# Altium project UZ_D_Voltage.PrjPCB (part 3 of 3)
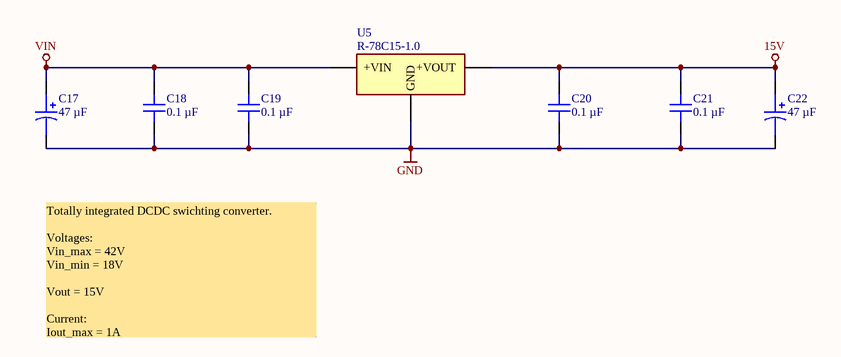
[diagram p17: 15V_PowerSupply.SchDoc]

## Nets that join several sheets
3V3_PER: TopSheet (R1.1), 3V3_to_5V (5 pins), SigCon_top/LS5V_top/LS5V_B (C1A.2 C2A.2 U6A.31 U6A.42), SigCon_top/LS5V_top/LS5V_A (C1B.2 C2B.2 U6B.31 U6B.42), SigCon_top/RS422_rec_top/RS422_rec_H (C6A.2 U4A.12 U4A.16), SigCon_top/RS422_rec_top/RS422_rec1 (C6B.2 U4B.12 U4B.16), SigCon_top/RS422_rec_top/RS422_rec2 (C6C.2 U4C.12 U4C.16), SigCon_top/RS422_rec_top/RS422_rec3 (C6D.2 U4D.12 U4D.16), SigCon_top/RS422_rec_top/RS422_rec4 (C6E.2 U4E.12 U4E.16), SigCon_top/RS422_rec_top/RS422_rec5 (C6F.2 U4F.12 U4F.16), SigCon_top/RS422_rec_top/RS422_rec6 (C6G.2 U4G.12 U4G.16), SigCon_top/RS422_rec_top/RS422_rec7 (C6H.2 U4H.12 U4H.16), SignalBundling (X3.10), DigitalCarrierPlug (X1.13 X1.14)
5V_PER: TopSheet (D1.2 D2.2), SigCon_top/LS5V_top/LS5V_B (C3A.2 C4A.2 U6A.7 U6A.18), SigCon_top/LS5V_top/LS5V_A (C3B.2 C4B.2 U6B.7 U6B.18), 5V_to_15V (R2.1), SigCon_top/LS15V_top/LS15V1 (C23A.2 U2A.1), SigCon_top/LS15V_top/LS15V2 (C23B.2 U2B.1), SigCon_top/LS15V_top/LS15V3 (C23C.2 U2C.1), SigCon_top/LS15V_top/LS15V4 (C23D.2 U2D.1), SigCon_top/LS15V_top/LS15V5 (C23E.2 U2E.1), SigCon_top/RS422_top/RS422A (C5A.2 U3A.12 U3A.16), SigCon_top/RS422_top/RS4221 (C5B.2 U3B.12 U3B.16), SigCon_top/RS422_top/RS4222 (C5C.2 U3C.12 U3C.16), SigCon_top/RS422_top/RS4223 (C5D.2 U3D.12 U3D.16), SigCon_top/RS422_top/RS4224 (C5E.2 U3E.12 U3E.16), SigCon_top/RS422_top/RS4225 (C5F.2 U3F.12 U3F.16), SigCon_top/RS422_top/RS4226 (C5G.2 U3G.12 U3G.16), SigCon_top/RS422_top/RS4227 (C5H.2 U3H.12 U3H.16), SigCon_top/RS422_rec_top/RS422_rec_H (U4A.1 U4A.7), SignalBundling (X3.20), DigitalCarrierPlug (X1.9 X1.10)
15V: SigCon_top/LS15V_top/LS15V1 (C24A.2 U2A.16), SigCon_top/LS15V_top/LS15V2 (C24B.2 U2B.16), SigCon_top/LS15V_top/LS15V3 (C24C.2 U2C.16), SigCon_top/LS15V_top/LS15V4 (C24D.2 U2D.16), SigCon_top/LS15V_top/LS15V5 (C24E.2 U2E.16), SignalBundling (X2.10), 15V_PowerSupply (C20.2 C21.2 C22.1 U5.3)
GND: TopSheet (R9.1 R10.1 R11.1), 3V3_to_5V (6 pins), SigCon_top/LS5V_top/LS5V_B (12 pins), SigCon_top/LS5V_top/LS5V_A (12 pins), 5V_to_15V (R12.1), SigCon_top/LS15V_top/LS15V1 (C23A.1 C24A.1 U2A.8), SigCon_top/LS15V_top/LS15V2 (C23B.1 C24B.1 U2B.8), SigCon_top/LS15V_top/LS15V3 (C23C.1 C24C.1 U2C.8), SigCon_top/LS15V_top/LS15V4 (C23D.1 C24D.1 U2D.8), SigCon_top/LS15V_top/LS15V5 (C23E.1 C24E.1 U2E.8), SigCon_top/RS422_top/RS422A (C5A.1 U3A.1 U3A.7 U3A.8), SigCon_top/RS422_top/RS4221 (C5B.1 U3B.8), SigCon_top/RS422_top/RS4222 (C5C.1 U3C.8), SigCon_top/RS422_top/RS4223 (C5D.1 U3D.8), SigCon_top/RS422_top/RS4224 (C5E.1 U3E.8), SigCon_top/RS422_top/RS4225 (C5F.1 U3F.8), SigCon_top/RS422_top/RS4226 (C5G.1 U3G.8), SigCon_top/RS422_top/RS4227 (C5H.1 U3H.8), SigCon_top/RS422_rec_top/RS422_rec_H (C6A.1 U4A.2 U4A.6 U4A.8), SigCon_top/RS422_rec_top/RS422_rec1 (C6B.1 U4B.8), SigCon_top/RS422_rec_top/RS422_rec2 (C6C.1 U4C.8), SigCon_top/RS422_rec_top/RS422_rec3 (C6D.1 U4D.8), SigCon_top/RS422_rec_top/RS422_rec4 (C6E.1 U4E.8), SigCon_top/RS422_rec_top/RS422_rec5 (C6F.1 U4F.8), SigCon_top/RS422_rec_top/RS422_rec6 (C6G.1 U4G.8), SigCon_top/RS422_rec_top/RS422_rec7 (C6H.1 U4H.8), SignalBundling (35 pins), DigitalCarrierPlug (47 pins), 15V_PowerSupply (7 pins)
VIN: SignalBundling (X2.1 X3.1), DigitalCarrierPlug (X1.5 X1.6), 15V_PowerSupply (C17.1 C18.2 C19.2 U5.1)
1B1: SigCon_top/LS5V_top/LS5V_B (U6A.2), Jumper5VLS (R65.2), Snubber5VLS (R159.1)
1B2: SigCon_top/LS5V_top/LS5V_B (U6A.3), Jumper5VLS (R66.2), Snubber5VLS (R158.1)
1B3: SigCon_top/LS5V_top/LS5V_B (U6A.5), Jumper5VLS (R67.2), Snubber5VLS (R157.1)
1B3: SigCon_top/LS5V_top/LS5V_A (U6B.5), Jumper5VLS (R51.2), Snubber5VLS (R173.1)
1B4: SigCon_top/LS5V_top/LS5V_B (U6A.6), Jumper5VLS (R68.2), Snubber5VLS (R156.1)
1B4: SigCon_top/LS5V_top/LS5V_A (U6B.6), Jumper5VLS (R52.2), Snubber5VLS (R172.1)
1B5: SigCon_top/LS5V_top/LS5V_B (U6A.8), Jumper5VLS (R69.2), Snubber5VLS (R155.1)
1B5: SigCon_top/LS5V_top/LS5V_A (U6B.8), Jumper5VLS (R53.2), Snubber5VLS (R171.1)
1B6: SigCon_top/LS5V_top/LS5V_B (U6A.9), Jumper5VLS (R70.2), Snubber5VLS (R154.1)
1B6: SigCon_top/LS5V_top/LS5V_A (U6B.9), Jumper5VLS (R54.2), Snubber5VLS (R170.1)
1B7: SigCon_top/LS5V_top/LS5V_B (U6A.11), Jumper5VLS (R71.2), Snubber5VLS (R153.1)
1B7: SigCon_top/LS5V_top/LS5V_A (U6B.11), Jumper5VLS (R55.2), Snubber5VLS (R169.1)
1B8: SigCon_top/LS5V_top/LS5V_B (U6A.12), Jumper5VLS (R72.2), Snubber5VLS (R152.1)
1B8: SigCon_top/LS5V_top/LS5V_A (U6B.12), Jumper5VLS (R56.2), Snubber5VLS (R168.1)
2B1: SigCon_top/LS5V_top/LS5V_B (U6A.13), Jumper5VLS (R73.2), Snubber5VLS (R151.1)
2B1: SigCon_top/LS5V_top/LS5V_A (U6B.13), Jumper5VLS (R57.2), Snubber5VLS (R167.1)
2B2: SigCon_top/LS5V_top/LS5V_B (U6A.14), Jumper5VLS (R74.2), Snubber5VLS (R150.1)
2B2: SigCon_top/LS5V_top/LS5V_A (U6B.14), Jumper5VLS (R58.2), Snubber5VLS (R166.1)
2B3: SigCon_top/LS5V_top/LS5V_B (U6A.16), Jumper5VLS (R75.2), Snubber5VLS (R149.1)
2B3: SigCon_top/LS5V_top/LS5V_A (U6B.16), Jumper5VLS (R59.2), Snubber5VLS (R165.1)
2B4: SigCon_top/LS5V_top/LS5V_B (U6A.17), Jumper5VLS (R76.2), Snubber5VLS (R148.1)
2B4: SigCon_top/LS5V_top/LS5V_A (U6B.17), Jumper5VLS (R60.2), Snubber5VLS (R164.1)
2B5: SigCon_top/LS5V_top/LS5V_B (U6A.19), Jumper5VLS (R77.2), Snubber5VLS (R147.1)
2B5: SigCon_top/LS5V_top/LS5V_A (U6B.19), Jumper5VLS (R61.2), Snubber5VLS (R163.1)
2B6: SigCon_top/LS5V_top/LS5V_B (U6A.20), Jumper5VLS (R78.2), Snubber5VLS (R146.1)
2B6: SigCon_top/LS5V_top/LS5V_A (U6B.20), Jumper5VLS (R62.2), Snubber5VLS (R162.1)
2B7: SigCon_top/LS5V_top/LS5V_B (U6A.22), Jumper5VLS (R79.2), Snubber5VLS (R145.1)
2B7: SigCon_top/LS5V_top/LS5V_A (U6B.22), Jumper5VLS (R63.2), Snubber5VLS (R161.1)
2B8: SigCon_top/LS5V_top/LS5V_B (U6A.23), Jumper5VLS (R80.2), Snubber5VLS (R144.1)
2B8: SigCon_top/LS5V_top/LS5V_A (U6B.23), Jumper5VLS (R64.2), Snubber5VLS (R160.1)
DIG_I_DIFF_A_N1: SigCon_top/RS422_top/RS4221 (U3B.11), SigCon_top/RS422_rec_top/RS422_rec1 (U4B.15), TermSingleAndDiff (R81.1)
DIG_I_DIFF_A_N2: SigCon_top/RS422_top/RS4222 (U3C.11), SigCon_top/RS422_rec_top/RS422_rec2 (U4C.15), TermSingleAndDiff (R89.1)
DIG_I_DIFF_A_N3: SigCon_top/RS422_top/RS4223 (U3D.11), SigCon_top/RS422_rec_top/RS422_rec3 (U4D.15), TermSingleAndDiff (R113.1)
DIG_I_DIFF_A_N4: SigCon_top/RS422_top/RS4224 (U3E.11), SigCon_top/RS422_rec_top/RS422_rec4 (U4E.15), TermSingleAndDiff (R121.1)
DIG_I_DIFF_A_N5: SigCon_top/RS422_top/RS4225 (U3F.11), SigCon_top/RS422_rec_top/RS422_rec5 (U4F.9), TermSingleAndDiff (R97.1)
DIG_I_DIFF_A_N6: SigCon_top/RS422_top/RS4226 (U3G.11), SigCon_top/RS422_rec_top/RS422_rec6 (U4G.9), TermSingleAndDiff (R105.1)
DIG_I_DIFF_A_N7: SigCon_top/RS422_top/RS4227 (U3H.11), SigCon_top/RS422_rec_top/RS422_rec7 (U4H.9), TermSingleAndDiff (R129.1)
DIG_I_DIFF_A_N8: SigCon_top/RS422_top/RS422A (U3A.13), SigCon_top/RS422_rec_top/RS422_rec_H (U4A.9), TermSingleAndDiff (R137.1)
DIG_I_DIFF_A_P1: SigCon_top/RS422_top/RS4221 (U3B.10), SigCon_top/RS422_rec_top/RS422_rec1 (U4B.14), NetTieSingleAndDiff (NT1.2)
DIG_I_DIFF_A_P2: SigCon_top/RS422_top/RS4222 (U3C.10), SigCon_top/RS422_rec_top/RS422_rec2 (U4C.14), NetTieSingleAndDiff (NT5.1)
DIG_I_DIFF_A_P3: SigCon_top/RS422_top/RS4223 (U3D.10), SigCon_top/RS422_rec_top/RS422_rec3 (U4D.14), NetTieSingleAndDiff (NT9.2)
DIG_I_DIFF_A_P4: SigCon_top/RS422_top/RS4224 (U3E.10), SigCon_top/RS422_rec_top/RS422_rec4 (U4E.14), NetTieSingleAndDiff (NT13.2)
DIG_I_DIFF_A_P5: SigCon_top/RS422_top/RS4225 (U3F.10), SigCon_top/RS422_rec_top/RS422_rec5 (U4F.10), NetTieSingleAndDiff (NT17.1)
DIG_I_DIFF_A_P6: SigCon_top/RS422_top/RS4226 (U3G.10), SigCon_top/RS422_rec_top/RS422_rec6 (U4G.10), NetTieSingleAndDiff (NT21.2)
DIG_I_DIFF_A_P7: SigCon_top/RS422_top/RS4227 (U3H.10), SigCon_top/RS422_rec_top/RS422_rec7 (U4H.10), NetTieSingleAndDiff (NT25.1)
DIG_I_DIFF_A_P8: SigCon_top/RS422_top/RS422A (U3A.14), SigCon_top/RS422_rec_top/RS422_rec_H (U4A.10), NetTieSingleAndDiff (NT29.2)
DIG_I_DIFF_B_N1: SigCon_top/RS422_top/RS4221 (U3B.13), SigCon_top/RS422_rec_top/RS422_rec1 (U4B.9), TermSingleAndDiff (R83.1)
DIG_I_DIFF_B_N2: SigCon_top/RS422_top/RS4222 (U3C.13), SigCon_top/RS422_rec_top/RS422_rec2 (U4C.9), TermSingleAndDiff (R91.1)
DIG_I_DIFF_B_N3: SigCon_top/RS422_top/RS4223 (U3D.13), SigCon_top/RS422_rec_top/RS422_rec3 (U4D.9), TermSingleAndDiff (R115.1)
DIG_I_DIFF_B_N4: SigCon_top/RS422_top/RS4224 (U3E.13), SigCon_top/RS422_rec_top/RS422_rec4 (U4E.9), TermSingleAndDiff (R123.1)
DIG_I_DIFF_B_N5: SigCon_top/RS422_top/RS4225 (U3F.13), SigCon_top/RS422_rec_top/RS422_rec5 (U4F.15), TermSingleAndDiff (R99.1)
DIG_I_DIFF_B_N6: SigCon_top/RS422_top/RS4226 (U3G.13), SigCon_top/RS422_rec_top/RS422_rec6 (U4G.15), TermSingleAndDiff (R107.1)
DIG_I_DIFF_B_N7: SigCon_top/RS422_top/RS4227 (U3H.13), SigCon_top/RS422_rec_top/RS422_rec7 (U4H.15), TermSingleAndDiff (R131.1)
DIG_I_DIFF_B_P1: SigCon_top/RS422_top/RS4221 (U3B.14), SigCon_top/RS422_rec_top/RS422_rec1 (U4B.10), NetTieSingleAndDiff (NT2.2)
DIG_I_DIFF_B_P2: SigCon_top/RS422_top/RS4222 (U3C.14), SigCon_top/RS422_rec_top/RS422_rec2 (U4C.10), NetTieSingleAndDiff (NT6.2)
DIG_I_DIFF_B_P3: SigCon_top/RS422_top/RS4223 (U3D.14), SigCon_top/RS422_rec_top/RS422_rec3 (U4D.10), NetTieSingleAndDiff (NT10.1)
DIG_I_DIFF_B_P4: SigCon_top/RS422_top/RS4224 (U3E.14), SigCon_top/RS422_rec_top/RS422_rec4 (U4E.10), NetTieSingleAndDiff (NT14.1)
DIG_I_DIFF_B_P5: SigCon_top/RS422_top/RS4225 (U3F.14), SigCon_top/RS422_rec_top/RS422_rec5 (U4F.14), NetTieSingleAndDiff (NT18.2)
DIG_I_DIFF_B_P6: SigCon_top/RS422_top/RS4226 (U3G.14), SigCon_top/RS422_rec_top/RS422_rec6 (U4G.14), NetTieSingleAndDiff (NT22.1)
DIG_I_DIFF_B_P7: SigCon_top/RS422_top/RS4227 (U3H.14), SigCon_top/RS422_rec_top/RS422_rec7 (U4H.14), NetTieSingleAndDiff (NT26.1)
DIG_I_DIFF_C_N1: SigCon_top/RS422_top/RS4221 (U3B.5), SigCon_top/RS422_rec_top/RS422_rec1 (U4B.1), TermSingleAndDiff (R86.1)
DIG_I_DIFF_C_N2: SigCon_top/RS422_top/RS4222 (U3C.5), SigCon_top/RS422_rec_top/RS422_rec2 (U4C.1), TermSingleAndDiff (R94.1)
DIG_I_DIFF_C_N3: SigCon_top/RS422_top/RS4223 (U3D.5), SigCon_top/RS422_rec_top/RS422_rec3 (U4D.1), TermSingleAndDiff (R118.1)
DIG_I_DIFF_C_N4: SigCon_top/RS422_top/RS4224 (U3E.5), SigCon_top/RS422_rec_top/RS422_rec4 (U4E.1), TermSingleAndDiff (R126.1)
DIG_I_DIFF_C_N5: SigCon_top/RS422_top/RS4225 (U3F.5), SigCon_top/RS422_rec_top/RS422_rec5 (U4F.7), TermSingleAndDiff (R102.1)
DIG_I_DIFF_C_N6: SigCon_top/RS422_top/RS4226 (U3G.5), SigCon_top/RS422_rec_top/RS422_rec6 (U4G.7), TermSingleAndDiff (R110.1)
DIG_I_DIFF_C_N7: SigCon_top/RS422_top/RS4227 (U3H.5), SigCon_top/RS422_rec_top/RS422_rec7 (U4H.7), TermSingleAndDiff (R134.1)
DIG_I_DIFF_C_N8: SigCon_top/RS422_top/RS422A (U3A.11), SigCon_top/RS422_rec_top/RS422_rec_H (U4A.15), TermSingleAndDiff (R140.1)
DIG_I_DIFF_C_P1: SigCon_top/RS422_top/RS4221 (U3B.6), SigCon_top/RS422_rec_top/RS422_rec1 (U4B.2), NetTieSingleAndDiff (NT3.2)
DIG_I_DIFF_C_P2: SigCon_top/RS422_top/RS4222 (U3C.6), SigCon_top/RS422_rec_top/RS422_rec2 (U4C.2), NetTieSingleAndDiff (NT7.1)
DIG_I_DIFF_C_P3: SigCon_top/RS422_top/RS4223 (U3D.6), SigCon_top/RS422_rec_top/RS422_rec3 (U4D.2), NetTieSingleAndDiff (NT11.2)
DIG_I_DIFF_C_P4: SigCon_top/RS422_top/RS4224 (U3E.6), SigCon_top/RS422_rec_top/RS422_rec4 (U4E.2), NetTieSingleAndDiff (NT15.1)
DIG_I_DIFF_C_P5: SigCon_top/RS422_top/RS4225 (U3F.6), SigCon_top/RS422_rec_top/RS422_rec5 (U4F.6), NetTieSingleAndDiff (NT19.1)
DIG_I_DIFF_C_P6: SigCon_top/RS422_top/RS4226 (U3G.6), SigCon_top/RS422_rec_top/RS422_rec6 (U4G.6), NetTieSingleAndDiff (NT23.2)
DIG_I_DIFF_C_P7: SigCon_top/RS422_top/RS4227 (U3H.6), SigCon_top/RS422_rec_top/RS422_rec7 (U4H.6), NetTieSingleAndDiff (NT27.2)
DIG_I_DIFF_C_P8: SigCon_top/RS422_top/RS422A (U3A.10), SigCon_top/RS422_rec_top/RS422_rec_H (U4A.14), NetTieSingleAndDiff (NT30.2)
DIG_I_DIFF_D_N1: SigCon_top/RS422_top/RS4221 (U3B.3), SigCon_top/RS422_rec_top/RS422_rec1 (U4B.7), TermSingleAndDiff (R88.1)
DIG_I_DIFF_D_N2: SigCon_top/RS422_top/RS4222 (U3C.3), SigCon_top/RS422_rec_top/RS422_rec2 (U4C.7), TermSingleAndDiff (R96.1)
DIG_I_DIFF_D_N3: SigCon_top/RS422_top/RS4223 (U3D.3), SigCon_top/RS422_rec_top/RS422_rec3 (U4D.7), TermSingleAndDiff (R120.1)
DIG_I_DIFF_D_N4: SigCon_top/RS422_top/RS4224 (U3E.3), SigCon_top/RS422_rec_top/RS422_rec4 (U4E.7), TermSingleAndDiff (R128.1)
DIG_I_DIFF_D_N5: SigCon_top/RS422_top/RS4225 (U3F.3), SigCon_top/RS422_rec_top/RS422_rec5 (U4F.1), TermSingleAndDiff (R104.1)
DIG_I_DIFF_D_N6: SigCon_top/RS422_top/RS4226 (U3G.3), SigCon_top/RS422_rec_top/RS422_rec6 (U4G.1), TermSingleAndDiff (R112.1)
DIG_I_DIFF_D_N7: SigCon_top/RS422_top/RS4227 (U3H.3), SigCon_top/RS422_rec_top/RS422_rec7 (U4H.1), TermSingleAndDiff (R136.1)
DIG_I_DIFF_D_P1: SigCon_top/RS422_top/RS4221 (U3B.2), SigCon_top/RS422_rec_top/RS422_rec1 (U4B.6), NetTieSingleAndDiff (NT4.1)
DIG_I_DIFF_D_P2: SigCon_top/RS422_top/RS4222 (U3C.2), SigCon_top/RS422_rec_top/RS422_rec2 (U4C.6), NetTieSingleAndDiff (NT8.1)
DIG_I_DIFF_D_P3: SigCon_top/RS422_top/RS4223 (U3D.2), SigCon_top/RS422_rec_top/RS422_rec3 (U4D.6), NetTieSingleAndDiff (NT12.2)
DIG_I_DIFF_D_P4: SigCon_top/RS422_top/RS4224 (U3E.2), SigCon_top/RS422_rec_top/RS422_rec4 (U4E.6), NetTieSingleAndDiff (NT16.1)
DIG_I_DIFF_D_P5: SigCon_top/RS422_top/RS4225 (U3F.2), SigCon_top/RS422_rec_top/RS422_rec5 (U4F.2), NetTieSingleAndDiff (NT20.1)
DIG_I_DIFF_D_P6: SigCon_top/RS422_top/RS4226 (U3G.2), SigCon_top/RS422_rec_top/RS422_rec6 (U4G.2), NetTieSingleAndDiff (NT24.1)
DIG_I_DIFF_D_P7: SigCon_top/RS422_top/RS4227 (U3H.2), SigCon_top/RS422_rec_top/RS422_rec7 (U4H.2), NetTieSingleAndDiff (NT28.1)
DIG_IO_00: SigCon_top/LS5V_top/LS5V_B (U6A.26), Jumper5VLS (R80.1), DigitalCarrierPlug (X1.17)
DIG_IO_01: SigCon_top/LS5V_top/LS5V_B (U6A.27), Jumper5VLS (R79.1), DigitalCarrierPlug (X1.18)
DIG_IO_02: SigCon_top/LS5V_top/LS5V_B (U6A.29), Jumper5VLS (R78.1), DigitalCarrierPlug (X1.21)
DIG_IO_03: SigCon_top/LS5V_top/LS5V_B (U6A.30), Jumper5VLS (R77.1), DigitalCarrierPlug (X1.22)
DIG_IO_04: SigCon_top/LS5V_top/LS5V_B (U6A.32), Jumper5VLS (R76.1), DigitalCarrierPlug (X1.25)
DIG_IO_05: SigCon_top/LS5V_top/LS5V_B (U6A.33), Jumper5VLS (R75.1), DigitalCarrierPlug (X1.26)
DIG_IO_5V_A1: Snubber5VLS (R144.2), SigCon_top/LS15V_top/LS15V1 (R3A.1 U2A.3), SigCon_top/RS422_top/RS4221 (U3B.9), SigCon_top/RS422_rec_top/RS422_rec1 (U4B.13)
DIG_IO_5V_A2: Snubber5VLS (R150.2), SigCon_top/LS15V_top/LS15V2 (R3B.1 U2B.3), SigCon_top/RS422_top/RS4222 (U3C.7), SigCon_top/RS422_rec_top/RS422_rec2 (U4C.3)
DIG_IO_5V_A3: Snubber5VLS (R156.2), SigCon_top/LS15V_top/LS15V3 (R3C.1 U2C.3), SigCon_top/RS422_top/RS4224 (U3E.9), SigCon_top/RS422_rec_top/RS422_rec4 (U4E.13)
DIG_IO_5V_A4: Snubber5VLS (R162.2), SigCon_top/LS15V_top/LS15V4 (R3D.1 U2D.3), SigCon_top/RS422_top/RS4225 (U3F.7), SigCon_top/RS422_rec_top/RS422_rec5 (U4F.5)
DIG_IO_5V_A5: Snubber5VLS (R168.2), SigCon_top/LS15V_top/LS15V5 (R3E.1 U2E.3), SigCon_top/RS422_top/RS4227 (U3H.9), SigCon_top/RS422_rec_top/RS422_rec7 (U4H.11)
DIG_IO_5V_B1: Snubber5VLS (R145.2), SigCon_top/LS15V_top/LS15V1 (R4A.1 U2A.5), SigCon_top/RS422_top/RS4221 (U3B.15), SigCon_top/RS422_rec_top/RS422_rec1 (U4B.11)
DIG_IO_5V_B2: Snubber5VLS (R151.2), SigCon_top/LS15V_top/LS15V2 (R4B.1 U2B.5), SigCon_top/RS422_top/RS4222 (U3C.1), SigCon_top/RS422_rec_top/RS422_rec2 (U4C.5)
DIG_IO_5V_B3: Snubber5VLS (R157.2), SigCon_top/LS15V_top/LS15V3 (R4C.1 U2C.5), SigCon_top/RS422_top/RS4224 (U3E.15), SigCon_top/RS422_rec_top/RS422_rec4 (U4E.11)
DIG_IO_5V_B4: Snubber5VLS (R163.2), SigCon_top/LS15V_top/LS15V4 (R4D.1 U2D.5), SigCon_top/RS422_top/RS4225 (U3F.1), SigCon_top/RS422_rec_top/RS422_rec5 (U4F.3)
DIG_IO_5V_B5: Snubber5VLS (R169.2), SigCon_top/LS15V_top/LS15V5 (R4E.1 U2E.5), SigCon_top/RS422_top/RS4227 (U3H.15), SigCon_top/RS422_rec_top/RS422_rec7 (U4H.13)
DIG_IO_5V_C1: Snubber5VLS (R146.2), SigCon_top/LS15V_top/LS15V1 (R5A.1 U2A.7), SigCon_top/RS422_top/RS4221 (U3B.7), SigCon_top/RS422_rec_top/RS422_rec1 (U4B.3)
DIG_IO_5V_C2: Snubber5VLS (R152.2), SigCon_top/LS15V_top/LS15V2 (R5B.1 U2B.7), SigCon_top/RS422_top/RS4223 (U3D.9), SigCon_top/RS422_rec_top/RS422_rec3 (U4D.13)
DIG_IO_5V_C3: Snubber5VLS (R158.2), SigCon_top/LS15V_top/LS15V3 (R5C.1 U2C.7), SigCon_top/RS422_top/RS4224 (U3E.7), SigCon_top/RS422_rec_top/RS422_rec4 (U4E.3)
DIG_IO_5V_C4: Snubber5VLS (R164.2), SigCon_top/LS15V_top/LS15V4 (R5D.1 U2D.7), SigCon_top/RS422_top/RS4226 (U3G.9), SigCon_top/RS422_rec_top/RS422_rec6 (U4G.11)
DIG_IO_5V_C5: Snubber5VLS (R170.2), SigCon_top/LS15V_top/LS15V5 (R5E.1 U2E.7), SigCon_top/RS422_top/RS4227 (U3H.7), SigCon_top/RS422_rec_top/RS422_rec7 (U4H.5)
DIG_IO_5V_D1: Snubber5VLS (R147.2), SigCon_top/LS15V_top/LS15V1 (R8A.1 U2A.14), SigCon_top/RS422_top/RS4221 (U3B.1), SigCon_top/RS422_rec_top/RS422_rec1 (U4B.5)
DIG_IO_5V_D2: Snubber5VLS (R153.2), SigCon_top/LS15V_top/LS15V2 (R8B.1 U2B.14), SigCon_top/RS422_top/RS4223 (U3D.15), SigCon_top/RS422_rec_top/RS422_rec3 (U4D.11)
DIG_IO_5V_D3: Snubber5VLS (R159.2), SigCon_top/LS15V_top/LS15V3 (R8C.1 U2C.14), SigCon_top/RS422_top/RS4224 (U3E.1), SigCon_top/RS422_rec_top/RS422_rec4 (U4E.5)
DIG_IO_5V_D4: Snubber5VLS (R165.2), SigCon_top/LS15V_top/LS15V4 (R8D.1 U2D.14), SigCon_top/RS422_top/RS4226 (U3G.15), SigCon_top/RS422_rec_top/RS422_rec6 (U4G.13)
DIG_IO_5V_D5: Snubber5VLS (R171.2), SigCon_top/LS15V_top/LS15V5 (R8E.1 U2E.14), SigCon_top/RS422_top/RS4227 (U3H.1), SigCon_top/RS422_rec_top/RS422_rec7 (U4H.3)
DIG_IO_5V_E1: Snubber5VLS (R148.2), SigCon_top/LS15V_top/LS15V1 (R6A.1 U2A.9), SigCon_top/RS422_top/RS4222 (U3C.9), SigCon_top/RS422_rec_top/RS422_rec2 (U4C.13)
DIG_IO_5V_E2: Snubber5VLS (R154.2), SigCon_top/LS15V_top/LS15V2 (R6B.1 U2B.9), SigCon_top/RS422_top/RS4223 (U3D.7), SigCon_top/RS422_rec_top/RS422_rec3 (U4D.3)
DIG_IO_5V_E3: Snubber5VLS (R160.2), SigCon_top/LS15V_top/LS15V3 (R6C.1 U2C.9), SigCon_top/RS422_top/RS4225 (U3F.9), SigCon_top/RS422_rec_top/RS422_rec5 (U4F.11)
DIG_IO_5V_E4: Snubber5VLS (R166.2), SigCon_top/LS15V_top/LS15V4 (R6D.1 U2D.9), SigCon_top/RS422_top/RS4226 (U3G.7), SigCon_top/RS422_rec_top/RS422_rec6 (U4G.5)
DIG_IO_5V_E5: Snubber5VLS (R172.2), SigCon_top/LS15V_top/LS15V5 (R6E.1 U2E.9), SigCon_top/RS422_top/RS422A (U3A.15), SigCon_top/RS422_rec_top/RS422_rec_H (U4A.11)
DIG_IO_5V_F1: Snubber5VLS (R149.2), SigCon_top/LS15V_top/LS15V1 (R7A.1 U2A.11), SigCon_top/RS422_top/RS4222 (U3C.15), SigCon_top/RS422_rec_top/RS422_rec2 (U4C.11)
DIG_IO_5V_F2: Snubber5VLS (R155.2), SigCon_top/LS15V_top/LS15V2 (R7B.1 U2B.11), SigCon_top/RS422_top/RS4223 (U3D.1), SigCon_top/RS422_rec_top/RS422_rec3 (U4D.5)
DIG_IO_5V_F3: Snubber5VLS (R161.2), SigCon_top/LS15V_top/LS15V3 (R7C.1 U2C.11), SigCon_top/RS422_top/RS4225 (U3F.15), SigCon_top/RS422_rec_top/RS422_rec5 (U4F.13)
DIG_IO_5V_F4: Snubber5VLS (R167.2), SigCon_top/LS15V_top/LS15V4 (R7D.1 U2D.11), SigCon_top/RS422_top/RS4226 (U3G.1), SigCon_top/RS422_rec_top/RS422_rec6 (U4G.3)
DIG_IO_5V_F5: Snubber5VLS (R173.2), SigCon_top/LS15V_top/LS15V5 (R7E.1 U2E.11), SigCon_top/RS422_top/RS422A (U3A.9), SigCon_top/RS422_rec_top/RS422_rec_H (U4A.13)
DIG_IO_06: SigCon_top/LS5V_top/LS5V_B (U6A.35), Jumper5VLS (R74.1), DigitalCarrierPlug (X1.29)
DIG_IO_07: SigCon_top/LS5V_top/LS5V_B (U6A.36), Jumper5VLS (R73.1), DigitalCarrierPlug (X1.30)
DIG_IO_08: SigCon_top/LS5V_top/LS5V_B (U6A.37), Jumper5VLS (R72.1), DigitalCarrierPlug (X1.33)
DIG_IO_09: SigCon_top/LS5V_top/LS5V_B (U6A.38), Jumper5VLS (R71.1), DigitalCarrierPlug (X1.34)
DIG_IO_10: SigCon_top/LS5V_top/LS5V_B (U6A.40), Jumper5VLS (R70.1), DigitalCarrierPlug (X1.37)
DIG_IO_11: SigCon_top/LS5V_top/LS5V_B (U6A.41), Jumper5VLS (R69.1), DigitalCarrierPlug (X1.38)
DIG_IO_12: SigCon_top/LS5V_top/LS5V_B (U6A.43), Jumper5VLS (R68.1), DigitalCarrierPlug (X1.41)
DIG_IO_13: SigCon_top/LS5V_top/LS5V_B (U6A.44), Jumper5VLS (R67.1), DigitalCarrierPlug (X1.42)
DIG_IO_14: SigCon_top/LS5V_top/LS5V_B (U6A.46), Jumper5VLS (R66.1), DigitalCarrierPlug (X1.45)
DIG_IO_15: SigCon_top/LS5V_top/LS5V_B (U6A.47), Jumper5VLS (R65.1), DigitalCarrierPlug (X1.46)
DIG_IO_16: SigCon_top/LS5V_top/LS5V_A (U6B.26), Jumper5VLS (R64.1), DigitalCarrierPlug (X1.49)
DIG_IO_17: SigCon_top/LS5V_top/LS5V_A (U6B.27), Jumper5VLS (R63.1), DigitalCarrierPlug (X1.50)
DIG_IO_18: SigCon_top/LS5V_top/LS5V_A (U6B.29), Jumper5VLS (R62.1), DigitalCarrierPlug (X1.53)
DIG_IO_19: SigCon_top/LS5V_top/LS5V_A (U6B.30), Jumper5VLS (R61.1), DigitalCarrierPlug (X1.54)
DIG_IO_20: SigCon_top/LS5V_top/LS5V_A (U6B.32), Jumper5VLS (R60.1), DigitalCarrierPlug (X1.57)
DIG_IO_21: SigCon_top/LS5V_top/LS5V_A (U6B.33), Jumper5VLS (R59.1), DigitalCarrierPlug (X1.58)
DIG_IO_22: SigCon_top/LS5V_top/LS5V_A (U6B.35), Jumper5VLS (R58.1), DigitalCarrierPlug (X1.61)
DIG_IO_23: SigCon_top/LS5V_top/LS5V_A (U6B.36), Jumper5VLS (R57.1), DigitalCarrierPlug (X1.62)
DIG_IO_24: SigCon_top/LS5V_top/LS5V_A (U6B.37), Jumper5VLS (R56.1), DigitalCarrierPlug (X1.65)
DIG_IO_25: SigCon_top/LS5V_top/LS5V_A (U6B.38), Jumper5VLS (R55.1), DigitalCarrierPlug (X1.66)
DIG_IO_26: SigCon_top/LS5V_top/LS5V_A (U6B.40), Jumper5VLS (R54.1), DigitalCarrierPlug (X1.69)
DIG_IO_27: SigCon_top/LS5V_top/LS5V_A (U6B.41), Jumper5VLS (R53.1), DigitalCarrierPlug (X1.70)
DIG_IO_28: SigCon_top/LS5V_top/LS5V_A (U6B.43), Jumper5VLS (R52.1), DigitalCarrierPlug (X1.73)
DIG_IO_29: SigCon_top/LS5V_top/LS5V_A (U6B.44), Jumper5VLS (R51.1), DigitalCarrierPlug (X1.74)
DIG_IO_N0: SignalBundling (R21.1 X2.17), TermSingleAndDiff (R81.2)
DIG_IO_N1: SignalBundling (R22.1 X2.18), TermSingleAndDiff (R83.2)
DIG_IO_N2: SignalBundling (R23.1 X2.19), TermSingleAndDiff (R86.2)
DIG_IO_N3: SignalBundling (R24.1 X2.20), TermSingleAndDiff (R88.2)
DIG_IO_N4: SignalBundling (R25.1 X2.21), TermSingleAndDiff (R89.2)
DIG_IO_N5: SignalBundling (R26.1 X2.22), TermSingleAndDiff (R91.2)
DIG_IO_N6: SignalBundling (R27.1 X2.23), TermSingleAndDiff (R94.2)
DIG_IO_N7: SignalBundling (R28.1 X2.24), TermSingleAndDiff (R96.2)
DIG_IO_N8: SignalBundling (R29.1 X2.26), TermSingleAndDiff (R113.2)
DIG_IO_N9: SignalBundling (R30.1 X2.27), TermSingleAndDiff (R115.2)
DIG_IO_N10: SignalBundling (R31.1 X2.28), TermSingleAndDiff (R118.2)
DIG_IO_N11: SignalBundling (R32.1 X2.29), TermSingleAndDiff (R120.2)
DIG_IO_N12: SignalBundling (R33.1 X2.30), TermSingleAndDiff (R121.2)
DIG_IO_N13: SignalBundling (R34.1 X3.22), TermSingleAndDiff (R123.2)
DIG_IO_N14: SignalBundling (R35.1 X3.23), TermSingleAndDiff (R126.2)
DIG_IO_N15: SignalBundling (R36.1 X3.24), TermSingleAndDiff (R128.2)
DIG_IO_N16: SignalBundling (R37.1 X3.25), TermSingleAndDiff (R97.2)
DIG_IO_N17: SignalBundling (R38.1 X3.26), TermSingleAndDiff (R99.2)
DIG_IO_N18: SignalBundling (R39.1 X3.27), TermSingleAndDiff (R102.2)
DIG_IO_N19: SignalBundling (R40.1 X3.28), TermSingleAndDiff (R104.2)
DIG_IO_N20: SignalBundling (R41.1 X3.29), TermSingleAndDiff (R105.2)
DIG_IO_N21: SignalBundling (R42.1 X3.31), TermSingleAndDiff (R107.2)
DIG_IO_N22: SignalBundling (R43.1 X3.32), TermSingleAndDiff (R110.2)
DIG_IO_N23: SignalBundling (R44.1 X3.33), TermSingleAndDiff (R112.2)
DIG_IO_N24: SignalBundling (R45.1 X3.34), TermSingleAndDiff (R129.2)
DIG_IO_N25: SignalBundling (R46.1 X3.35), TermSingleAndDiff (R131.2)
DIG_IO_N26: SignalBundling (R47.1 X3.36), TermSingleAndDiff (R134.2)
DIG_IO_N27: SignalBundling (R48.1 X3.37), TermSingleAndDiff (R136.2)
DIG_IO_N28: SignalBundling (R49.1 X3.38), TermSingleAndDiff (R137.2)
DIG_IO_N29: SignalBundling (R50.1 X3.39), TermSingleAndDiff (R140.2)
DIG_IO_P0: SignalBundling (X2.2), TermSingleAndDiff (R82.2)
DIG_IO_P1: SignalBundling (X2.3), TermSingleAndDiff (R84.2)
DIG_IO_P2: SignalBundling (X2.4), TermSingleAndDiff (R85.2)
DIG_IO_P3: SignalBundling (X2.5), TermSingleAndDiff (R87.2)
DIG_IO_P4: SignalBundling (X2.6), TermSingleAndDiff (R90.2)
DIG_IO_P5: SignalBundling (X2.7), TermSingleAndDiff (R92.2)
DIG_IO_P6: SignalBundling (X2.8), TermSingleAndDiff (R93.2)
DIG_IO_P7: SignalBundling (X2.9), TermSingleAndDiff (R95.2)
DIG_IO_P8: SignalBundling (X2.11), TermSingleAndDiff (R114.2)
DIG_IO_P9: SignalBundling (X2.12), TermSingleAndDiff (R116.2)
DIG_IO_P10: SignalBundling (X2.13), TermSingleAndDiff (R117.2)
DIG_IO_P11: SignalBundling (X2.14), TermSingleAndDiff (R119.2)
DIG_IO_P12: SignalBundling (X2.15), TermSingleAndDiff (R122.2)
DIG_IO_P13: SignalBundling (X3.2), TermSingleAndDiff (R124.2)
DIG_IO_P14: SignalBundling (X3.3), TermSingleAndDiff (R125.2)
DIG_IO_P15: SignalBundling (X3.4), TermSingleAndDiff (R127.2)
DIG_IO_P16: SignalBundling (X3.5), TermSingleAndDiff (R98.2)
DIG_IO_P17: SignalBundling (X3.6), TermSingleAndDiff (R100.2)
DIG_IO_P18: SignalBundling (X3.7), TermSingleAndDiff (R101.2)
DIG_IO_P19: SignalBundling (X3.8), TermSingleAndDiff (R103.2)
DIG_IO_P20: SignalBundling (X3.9), TermSingleAndDiff (R106.2)
DIG_IO_P21: SignalBundling (X3.11), TermSingleAndDiff (R108.2)
DIG_IO_P22: SignalBundling (X3.12), TermSingleAndDiff (R109.2)
DIG_IO_P23: SignalBundling (X3.13), TermSingleAndDiff (R111.2)
DIG_IO_P24: SignalBundling (X3.14), TermSingleAndDiff (R130.2)
DIG_IO_P25: SignalBundling (X3.15), TermSingleAndDiff (R132.2)
DIG_IO_P26: SignalBundling (X3.16), TermSingleAndDiff (R133.2)
DIG_IO_P27: SignalBundling (X3.17), TermSingleAndDiff (R135.2)
DIG_IO_P28: SignalBundling (X3.18), TermSingleAndDiff (R138.2)
DIG_IO_P29: SignalBundling (X3.19), TermSingleAndDiff (R139.2)
DIG_IO_SINGLE_A1: SigCon_top/LS15V_top/LS15V1 (R3A.2 U2A.2), NetTieSingleAndDiff (NT1.1)
DIG_IO_SINGLE_A2: SigCon_top/LS15V_top/LS15V2 (R3B.2 U2B.2), NetTieSingleAndDiff (NT7.2)
DIG_IO_SINGLE_A3: SigCon_top/LS15V_top/LS15V3 (R3C.2 U2C.2), NetTieSingleAndDiff (NT13.1)
DIG_IO_SINGLE_A4: SigCon_top/LS15V_top/LS15V4 (R3D.2 U2D.2), NetTieSingleAndDiff (NT19.2)
DIG_IO_SINGLE_A5: SigCon_top/LS15V_top/LS15V5 (R3E.2 U2E.2), NetTieSingleAndDiff (NT25.2)
DIG_IO_SINGLE_B1: SigCon_top/LS15V_top/LS15V1 (R4A.2 U2A.4), NetTieSingleAndDiff (NT2.1)
DIG_IO_SINGLE_B2: SigCon_top/LS15V_top/LS15V2 (R4B.2 U2B.4), NetTieSingleAndDiff (NT8.2)
DIG_IO_SINGLE_B3: SigCon_top/LS15V_top/LS15V3 (R4C.2 U2C.4), NetTieSingleAndDiff (NT14.2)
DIG_IO_SINGLE_B4: SigCon_top/LS15V_top/LS15V4 (R4D.2 U2D.4), NetTieSingleAndDiff (NT20.2)
DIG_IO_SINGLE_B5: SigCon_top/LS15V_top/LS15V5 (R4E.2 U2E.4), NetTieSingleAndDiff (NT26.2)
DIG_IO_SINGLE_C1: SigCon_top/LS15V_top/LS15V1 (R5A.2 U2A.6), NetTieSingleAndDiff (NT3.1)
DIG_IO_SINGLE_C2: SigCon_top/LS15V_top/LS15V2 (R5B.2 U2B.6), NetTieSingleAndDiff (NT9.1)
DIG_IO_SINGLE_C3: SigCon_top/LS15V_top/LS15V3 (R5C.2 U2C.6), NetTieSingleAndDiff (NT15.2)
DIG_IO_SINGLE_C4: SigCon_top/LS15V_top/LS15V4 (R5D.2 U2D.6), NetTieSingleAndDiff (NT21.1)
DIG_IO_SINGLE_C5: SigCon_top/LS15V_top/LS15V5 (R5E.2 U2E.6), NetTieSingleAndDiff (NT27.1)
DIG_IO_SINGLE_D1: SigCon_top/LS15V_top/LS15V1 (R8A.2 U2A.15), NetTieSingleAndDiff (NT4.2)
DIG_IO_SINGLE_D2: SigCon_top/LS15V_top/LS15V2 (R8B.2 U2B.15), NetTieSingleAndDiff (NT10.2)
DIG_IO_SINGLE_D3: SigCon_top/LS15V_top/LS15V3 (R8C.2 U2C.15), NetTieSingleAndDiff (NT16.2)
DIG_IO_SINGLE_D4: SigCon_top/LS15V_top/LS15V4 (R8D.2 U2D.15), NetTieSingleAndDiff (NT22.2)
DIG_IO_SINGLE_D5: SigCon_top/LS15V_top/LS15V5 (R8E.2 U2E.15), NetTieSingleAndDiff (NT28.2)
DIG_IO_SINGLE_E1: SigCon_top/LS15V_top/LS15V1 (R6A.2 U2A.10), NetTieSingleAndDiff (NT5.2)
DIG_IO_SINGLE_E2: SigCon_top/LS15V_top/LS15V2 (R6B.2 U2B.10), NetTieSingleAndDiff (NT11.1)
DIG_IO_SINGLE_E3: SigCon_top/LS15V_top/LS15V3 (R6C.2 U2C.10), NetTieSingleAndDiff (NT17.2)
DIG_IO_SINGLE_E4: SigCon_top/LS15V_top/LS15V4 (R6D.2 U2D.10), NetTieSingleAndDiff (NT23.1)
DIG_IO_SINGLE_E5: SigCon_top/LS15V_top/LS15V5 (R6E.2 U2E.10), NetTieSingleAndDiff (NT29.1)
DIG_IO_SINGLE_F1: SigCon_top/LS15V_top/LS15V1 (R7A.2 U2A.12), NetTieSingleAndDiff (NT6.1)
DIG_IO_SINGLE_F2: SigCon_top/LS15V_top/LS15V2 (R7B.2 U2B.12), NetTieSingleAndDiff (NT12.1)
DIG_IO_SINGLE_F3: SigCon_top/LS15V_top/LS15V3 (R7C.2 U2C.12), NetTieSingleAndDiff (NT18.1)
DIG_IO_SINGLE_F4: SigCon_top/LS15V_top/LS15V4 (R7D.2 U2D.12), NetTieSingleAndDiff (NT24.2)
DIG_IO_SINGLE_F5: SigCon_top/LS15V_top/LS15V5 (R7E.2 U2E.12), NetTieSingleAndDiff (NT30.1)
DIR1: 3V3_to_5V (R20.1 SW1.5), SigCon_top/LS5V_top/LS5V_A (R16B.2)
DIR2: 3V3_to_5V (R141.1 SW1.6), SigCon_top/LS5V_top/LS5V_A (R17B.1)
DIR3: 3V3_to_5V (R142.1 SW1.7), SigCon_top/LS5V_top/LS5V_B (R16A.2)
DIR4: 3V3_to_5V (R143.1 SW1.8), SigCon_top/LS5V_top/LS5V_B (R17A.1)
ENABLE: TopSheet (R1.2 R13.2), 3V3_to_5V (U1.2), SigCon_top/RS422_top/RS422A (U3A.4), SigCon_top/RS422_top/RS4221 (U3B.4), SigCon_top/RS422_top/RS4222 (U3C.4), SigCon_top/RS422_top/RS4223 (U3D.4), SigCon_top/RS422_top/RS4224 (U3E.4), SigCon_top/RS422_top/RS4225 (U3F.4), SigCon_top/RS422_top/RS4226 (U3G.4), SigCon_top/RS422_top/RS4227 (U3H.4), SigCon_top/RS422_rec_top/RS422_rec_H (U4A.4), SigCon_top/RS422_rec_top/RS422_rec1 (U4B.4), SigCon_top/RS422_rec_top/RS422_rec2 (U4C.4), SigCon_top/RS422_rec_top/RS422_rec3 (U4D.4), SigCon_top/RS422_rec_top/RS422_rec4 (U4E.4), SigCon_top/RS422_rec_top/RS422_rec5 (U4F.4), SigCon_top/RS422_rec_top/RS422_rec6 (U4G.4), SigCon_top/RS422_rec_top/RS422_rec7 (U4H.4)
NetR2_2: 5V_to_15V (R2.2 R12.2), SigCon_top/LS15V_top/LS15V1 (U2A.13), SigCon_top/LS15V_top/LS15V2 (U2B.13), SigCon_top/LS15V_top/LS15V3 (U2C.13), SigCon_top/LS15V_top/LS15V4 (U2D.13), SigCon_top/LS15V_top/LS15V5 (U2E.13)
~{OE}: 3V3_to_5V (U1.4), SigCon_top/LS5V_top/LS5V_B (R18A.2 R19A.1), SigCon_top/LS5V_top/LS5V_A (R18B.2 R19B.1)
PS_DIG_GPIO_01: TopSheet (R13.1), DigitalCarrierPlug (X1.77)
UNTERM0: NetTieSingleAndDiff (NT1.3), TermSingleAndDiff (R82.1)
UNTERM1: NetTieSingleAndDiff (NT2.3), TermSingleAndDiff (R84.1)
UNTERM2: NetTieSingleAndDiff (NT3.3), TermSingleAndDiff (R85.1)
UNTERM3: NetTieSingleAndDiff (NT4.3), TermSingleAndDiff (R87.1)
UNTERM4: NetTieSingleAndDiff (NT5.3), TermSingleAndDiff (R90.1)
UNTERM5: NetTieSingleAndDiff (NT6.3), TermSingleAndDiff (R92.1)
UNTERM6: NetTieSingleAndDiff (NT7.3), TermSingleAndDiff (R93.1)
UNTERM7: NetTieSingleAndDiff (NT8.3), TermSingleAndDiff (R95.1)
UNTERM8: NetTieSingleAndDiff (NT9.3), TermSingleAndDiff (R114.1)
UNTERM9: NetTieSingleAndDiff (NT10.3), TermSingleAndDiff (R116.1)
UNTERM10: NetTieSingleAndDiff (NT11.3), TermSingleAndDiff (R117.1)
UNTERM11: NetTieSingleAndDiff (NT12.3), TermSingleAndDiff (R119.1)
UNTERM12: NetTieSingleAndDiff (NT13.3), TermSingleAndDiff (R122.1)
UNTERM13: NetTieSingleAndDiff (NT14.3), TermSingleAndDiff (R124.1)
UNTERM14: NetTieSingleAndDiff (NT15.3), TermSingleAndDiff (R125.1)
UNTERM15: NetTieSingleAndDiff (NT16.3), TermSingleAndDiff (R127.1)
UNTERM16: NetTieSingleAndDiff (NT17.3), TermSingleAndDiff (R98.1)
UNTERM17: NetTieSingleAndDiff (NT18.3), TermSingleAndDiff (R100.1)
UNTERM18: NetTieSingleAndDiff (NT19.3), TermSingleAndDiff (R101.1)
UNTERM19: NetTieSingleAndDiff (NT20.3), TermSingleAndDiff (R103.1)
UNTERM20: NetTieSingleAndDiff (NT21.3), TermSingleAndDiff (R106.1)
UNTERM21: NetTieSingleAndDiff (NT22.3), TermSingleAndDiff (R108.1)
UNTERM22: NetTieSingleAndDiff (NT23.3), TermSingleAndDiff (R109.1)
UNTERM23: NetTieSingleAndDiff (NT24.3), TermSingleAndDiff (R111.1)
UNTERM24: NetTieSingleAndDiff (NT25.3), TermSingleAndDiff (R130.1)
UNTERM25: NetTieSingleAndDiff (NT26.3), TermSingleAndDiff (R132.1)
UNTERM26: NetTieSingleAndDiff (NT27.3), TermSingleAndDiff (R133.1)
UNTERM27: NetTieSingleAndDiff (NT28.3), TermSingleAndDiff (R135.1)
UNTERM28: NetTieSingleAndDiff (NT29.3), TermSingleAndDiff (R138.1)
UNTERM29: NetTieSingleAndDiff (NT30.3), TermSingleAndDiff (R139.1)

## Assembly variants
3V3_to_3V3_IO: not fitted C1A C1B C2A C2B C3A C3B C4A C4B C5A C5B C5C C5D C5E C5F C5G C5H C6A C6B C6C C6D C6E C6F C6G C6H C17 C18 C19 C20 C21 C22 C23A C23B C23C C23D C23E C24A C24B C24C C24D C24E D2 R2 R10 R11 R12 R13 R14 R15 R16A R16B R17A R17B R18A R18B R19A R19B R20 R81 R83 R86 R88 R89 R91 R94 R96 R97 R99 R102 R104 R105 R107 R110 R112 R113 R115 R118 R120 R121 R123 R126 R128 R129 R131 R134 R136 R137 R140 R141 R142 R143 SW1 U1 U2A U2B U2C U2D U2E U3A U3B U3C U3D U3E U3F U3G U3H U4A U4B U4C U4D U4E U4F U4G U4H U5 U6A U6B; alternate parts D1 -> FC-DA1608HOK-600H
3V3_to_5V_IO: not fitted C5A C5B C5C C5D C5E C5F C5G C5H C6A C6B C6C C6D C6E C6F C6G C6H C17 C18 C19 C20 C21 C22 C23A C23B C23C C23D C23E C24A C24B C24C C24D C24E D2 R2 R11 R12 R13 R14 R15 R51 R52 R53 R54 R55 R56 R57 R58 R59 R60 R61 R62 R63 R64 R65 R66 R67 R68 R69 R70 R71 R72 R73 R74 R75 R76 R77 R78 R79 R80 R81 R83 R86 R88 R89 R91 R94 R96 R97 R99 R102 R104 R105 R107 R110 R112 R113 R115 R118 R120 R121 R123 R126 R128 R129 R131 R134 R136 R137 R140 U2A U2B U2C U2D U2E U3A U3B U3C U3D U3E U3F U3G U3H U4A U4B U4C U4D U4E U4F U4G U4H U5; alternate parts D1 -> 19-217/BHC-ZL1M2RY/3T
3V3_to_15V_output: not fitted C5A C5B C5C C5D C5E C5F C5G C5H C6A C6B C6C C6D C6E C6F C6G C6H D2 R2 R3A R3B R3C R3D R3E R4A R4B R4C R4D R4E R5A R5B R5C R5D R5E R6A R6B R6C R6D R6E R7A R7B R7C R7D R7E R8A R8B R8C R8D R8E R11 R13 R14 R15 R20 R51 R52 R53 R54 R55 R56 R57 R58 R59 R60 R61 R62 R63 R64 R65 R66 R67 R68 R69 R70 R71 R72 R73 R74 R75 R76 R77 R78 R79 R80 R81 R83 R86 R88 R89 R91 R94 R96 R97 R99 R102 R104 R105 R107 R110 R112 R113 R115 R118 R120 R121 R123 R126 R128 R129 R131 R134 R136 R137 R140 R141 R142 R143 SW1 U3A U3B U3C U3D U3E U3F U3G U3H U4A U4B U4C U4D U4E U4F U4G U4H; alternate parts D1 -> 19-217/GHC-YR1S2/3T
3V3_to_RS422_output: not fitted C1A C1B C2A C2B C3A C3B C4A C4B C6A C6B C6C C6D C6E C6F C6G C6H C17 C18 C19 C20 C21 C22 C23A C23B C23C C23D C23E C24A C24B C24C C24D C24E D2 R2 R3A R3B R3C R3D R3E R4A R4B R4C R4D R4E R5A R5B R5C R5D R5E R6A R6B R6C R6D R6E R7A R7B R7C R7D R7E R8A R8B R8C R8D R8E R10 R11 R12 R13 R14 R15 R16A R16B R17A R17B R18A R18B R19A R19B R20 R21 R22 R23 R24 R25 R26 R27 R28 R29 R30 R31 R32 R33 R34 R35 R36 R37 R38 R39 R40 R41 R42 R43 R44 R45 R46 R47 R48 R49 R50 R141 R142 R143 SW1 U1 U2A U2B U2C U2D U2E U4A U4B U4C U4D U4E U4F U4G U4H U5 U6A U6B; alternate parts D1 -> KT-0603R, R144 -> RC0603JR-070RL, R173 -> RC0603JR-070RL, R172 -> RC0603JR-070RL, R171 -> RC0603JR-070RL, R170 -> RC0603JR-070RL, R169 -> RC0603JR-070RL, R168 -> RC0603JR-070RL, R167 -> RC0603JR-070RL, R166 -> RC0603JR-070RL, R165 -> RC0603JR-070RL, R164 -> RC0603JR-070RL, R163 -> RC0603JR-070RL, R162 -> RC0603JR-070RL, R161 -> RC0603JR-070RL, R160 -> RC0603JR-070RL, R159 -> RC0603JR-070RL, R158 -> RC0603JR-070RL, R157 -> RC0603JR-070RL, R156 -> RC0603JR-070RL, R155 -> RC0603JR-070RL, R154 -> RC0603JR-070RL, R153 -> RC0603JR-070RL, R152 -> RC0603JR-070RL, R151 -> RC0603JR-070RL, R150 -> RC0603JR-070RL, R149 -> RC0603JR-070RL, R148 -> RC0603JR-070RL, R147 -> RC0603JR-070RL, R146 -> RC0603JR-070RL, R145 -> RC0603JR-070RL
RS422_to_3V3_input: not fitted C1A C1B C2A C2B C3A C3B C4A C4B C5A C5B C5C C5D C5E C5F C5G C5H C17 C18 C19 C20 C21 C22 C23A C23B C23C C23D C23E C24A C24B C24C C24D C24E D2 R2 R3A R3B R3C R3D R3E R4A R4B R4C R4D R4E R5A R5B R5C R5D R5E R6A R6B R6C R6D R6E R7A R7B R7C R7D R7E R8A R8B R8C R8D R8E R10 R11 R12 R13 R14 R15 R16A R16B R17A R17B R18A R18B R19A R19B R20 R21 R22 R23 R24 R25 R26 R27 R28 R29 R30 R31 R32 R33 R34 R35 R36 R37 R38 R39 R40 R41 R42 R43 R44 R45 R46 R47 R48 R49 R50 R141 R142 R143 SW1 U1 U2A U2B U2C U2D U2E U3A U3B U3C U3D U3E U3F U3G U3H U5 U6A U6B; alternate parts D1 -> 19-213/Y2C-CQ2R2L/3T(CY), R144 -> RC0603JR-070RL, R173 -> RC0603JR-070RL, R172 -> RC0603JR-070RL, R171 -> RC0603JR-070RL, R170 -> RC0603JR-070RL, R169 -> RC0603JR-070RL, R168 -> RC0603JR-070RL, R167 -> RC0603JR-070RL, R166 -> RC0603JR-070RL, R165 -> RC0603JR-070RL, R164 -> RC0603JR-070RL, R163 -> RC0603JR-070RL, R162 -> RC0603JR-070RL, R161 -> RC0603JR-070RL, R160 -> RC0603JR-070RL, R159 -> RC0603JR-070RL, R158 -> RC0603JR-070RL, R157 -> RC0603JR-070RL, R156 -> RC0603JR-070RL, R155 -> RC0603JR-070RL, R154 -> RC0603JR-070RL, R153 -> RC0603JR-070RL, R152 -> RC0603JR-070RL, R151 -> RC0603JR-070RL, R150 -> RC0603JR-070RL, R149 -> RC0603JR-070RL, R148 -> RC0603JR-070RL, R147 -> RC0603JR-070RL, R146 -> RC0603JR-070RL, R145 -> RC0603JR-070RL
RS422_input_output: not fitted C1A C1B C2A C2B C3A C3B C4A C4B C5A C5G C5H C6A C6B C6C C6D C6E C17 C18 C19 C20 C21 C22 C23A C23B C23C C23D C23E C24A C24B C24C C24D C24E R2 R3A R3B R3C R3D R3E R4A R4B R4C R4D R4E R5A R5B R5C R5D R5E R6A R6B R6C R6D R6E R7A R7B R7C R7D R7E R8A R8B R8C R8D R8E R10 R12 R13 R14 R15 R16A R16B R17A R17B R18A R18B R19A R19B R20 R21 R22 R23 R24 R25 R26 R27 R28 R29 R30 R31 R32 R33 R34 R35 R36 R37 R38 R39 R40 R41 R42 R43 R44 R45 R46 R47 R48 R49 R50 R141 R142 R143 SW1 U1 U2A U2B U2C U2D U2E U3A U3G U3H U4A U4B U4C U4D U4E U5 U6A U6B; alternate parts D1 -> KT-0603R, D2 -> 19-213/Y2C-CQ2R2L/3T(CY), R144 -> RC0603JR-070RL, R173 -> RC0603JR-070RL, R172 -> RC0603JR-070RL, R171 -> RC0603JR-070RL, R170 -> RC0603JR-070RL, R169 -> RC0603JR-070RL, R168 -> RC0603JR-070RL, R167 -> RC0603JR-070RL, R166 -> RC0603JR-070RL, R165 -> RC0603JR-070RL, R164 -> RC0603JR-070RL, R163 -> RC0603JR-070RL, R162 -> RC0603JR-070RL, R161 -> RC0603JR-070RL, R160 -> RC0603JR-070RL, R159 -> RC0603JR-070RL, R158 -> RC0603JR-070RL, R157 -> RC0603JR-070RL, R156 -> RC0603JR-070RL, R155 -> RC0603JR-070RL, R154 -> RC0603JR-070RL, R153 -> RC0603JR-070RL, R152 -> RC0603JR-070RL, R151 -> RC0603JR-070RL, R150 -> RC0603JR-070RL, R149 -> RC0603JR-070RL, R148 -> RC0603JR-070RL, R147 -> RC0603JR-070RL, R146 -> RC0603JR-070RL, R145 -> RC0603JR-070RL